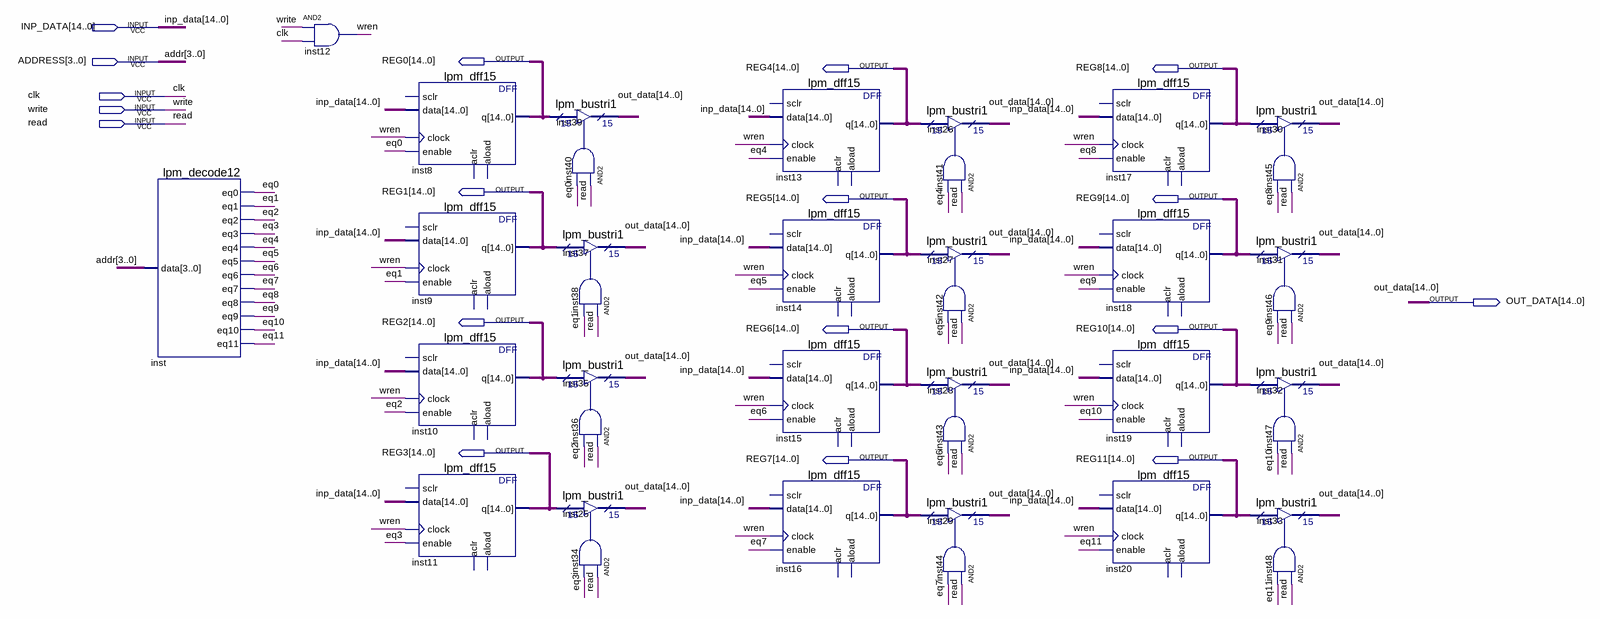
[diagram p0: schematic sheet]
// Quartus schematic GPR.bdf as structural Verilog: 38 symbols, 18 pins
module GPR (
  input  [14:0] INP_DATA,
  input  [3:0] ADDRESS,
  input  clk,
  input  write,
  input  read,
  output [14:0] REG0,
  output [14:0] REG4,
  output [14:0] REG8,
  output [14:0] REG1,
  output [14:0] REG5,
  output [14:0] REG9,
  output [14:0] OUT_DATA,
  output [14:0] REG2,
  output [14:0] REG6,
  output [14:0] REG10,
  output [14:0] REG3,
  output [14:0] REG7,
  output [14:0] REG11
);

  wire eq0, eq1, eq2, eq3, eq4, eq5, eq6, eq7, eq8, eq9, eq10, eq11, inst34_out, inst36_out, inst38_out,
       inst40_out, inst41_out, inst42_out, inst43_out, inst44_out, inst45_out, inst46_out, inst47_out,
       inst48_out, wren;

  lpm_decode12 inst (
    .data(ADDRESS), .eq0(eq0), .eq1(eq1), .eq2(eq2), .eq3(eq3), .eq4(eq4), .eq5(eq5), .eq6(eq6), .eq7(eq7),
    .eq8(eq8), .eq9(eq9), .eq10(eq10), .eq11(eq11));
  and inst12 (wren, write, clk);
  lpm_dff15 inst8 (.data(INP_DATA), .clock(wren), .enable(eq0), .q(REG0));  // open: sclr, aclr, aload
  lpm_dff15 inst9 (.data(INP_DATA), .clock(wren), .enable(eq1), .q(REG1));  // open: sclr, aclr, aload
  lpm_dff15 inst10 (.data(INP_DATA), .clock(wren), .enable(eq2), .q(REG2));  // open: sclr, aclr, aload
  lpm_dff15 inst11 (.data(INP_DATA), .clock(wren), .enable(eq3), .q(REG3));  // open: sclr, aclr, aload
  lpm_bustri1 inst39 (.enabledt(inst40_out), .data(REG0), .tridata(OUT_DATA));
  and inst40 (inst40_out, read, eq0);
  lpm_bustri1 inst37 (.enabledt(inst38_out), .data(REG1), .tridata(OUT_DATA));
  and inst38 (inst38_out, read, eq1);
  lpm_bustri1 inst35 (.enabledt(inst36_out), .data(REG2), .tridata(OUT_DATA));
  and inst36 (inst36_out, read, eq2);
  lpm_bustri1 inst25 (.enabledt(inst34_out), .data(REG3), .tridata(OUT_DATA));
  and inst34 (inst34_out, read, eq3);
  lpm_dff15 inst13 (.data(INP_DATA), .clock(wren), .enable(eq4), .q(REG4));  // open: sclr, aclr, aload
  lpm_dff15 inst14 (.data(INP_DATA), .clock(wren), .enable(eq5), .q(REG5));  // open: sclr, aclr, aload
  lpm_dff15 inst15 (.data(INP_DATA), .clock(wren), .enable(eq6), .q(REG6));  // open: sclr, aclr, aload
  lpm_dff15 inst16 (.data(INP_DATA), .clock(wren), .enable(eq7), .q(REG7));  // open: sclr, aclr, aload
  lpm_bustri1 inst26 (.enabledt(inst41_out), .data(REG4), .tridata(OUT_DATA));
  and inst41 (inst41_out, read, eq4);
  lpm_bustri1 inst27 (.enabledt(inst42_out), .data(REG5), .tridata(OUT_DATA));
  and inst42 (inst42_out, read, eq5);
  lpm_bustri1 inst28 (.enabledt(inst43_out), .data(REG6), .tridata(OUT_DATA));
  and inst43 (inst43_out, read, eq6);
  lpm_bustri1 inst29 (.enabledt(inst44_out), .data(REG7), .tridata(OUT_DATA));
  and inst44 (inst44_out, read, eq7);
  lpm_dff15 inst17 (.data(INP_DATA), .clock(wren), .enable(eq8), .q(REG8));  // open: sclr, aclr, aload
  lpm_dff15 inst18 (.data(INP_DATA), .clock(wren), .enable(eq9), .q(REG9));  // open: sclr, aclr, aload
  lpm_dff15 inst19 (.data(INP_DATA), .clock(wren), .enable(eq10), .q(REG10));  // open: sclr, aclr, aload
  lpm_dff15 inst20 (.data(INP_DATA), .clock(wren), .enable(eq11), .q(REG11));  // open: sclr, aclr, aload
  lpm_bustri1 inst30 (.enabledt(inst45_out), .data(REG8), .tridata(OUT_DATA));
  and inst45 (inst45_out, read, eq8);
  lpm_bustri1 inst31 (.enabledt(inst46_out), .data(REG9), .tridata(OUT_DATA));
  and inst46 (inst46_out, read, eq9);
  lpm_bustri1 inst32 (.enabledt(inst47_out), .data(REG10), .tridata(OUT_DATA));
  and inst47 (inst47_out, read, eq10);
  lpm_bustri1 inst33 (.enabledt(inst48_out), .data(REG11), .tridata(OUT_DATA));
  and inst48 (inst48_out, read, eq11);

  // Other names for the same wires on the sheet: addr[3:0] = ADDRESS
endmodule
